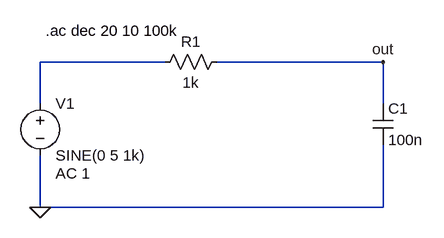
[diagram p0: schematic rc_high_pass_simple.asc]
rc_high_pass_simple.asc, the LTspice schematic file:
Version 4.1
SHEET 1 880 680
WIRE 160 -48 -32 -48
WIRE 496 -48 240 -48
WIRE -32 16 -32 -48
WIRE 496 16 496 -48
WIRE -32 176 -32 96
WIRE 496 176 496 80
WIRE 496 176 -32 176
FLAG -32 176 0
FLAG 496 -48 out
SYMBOL voltage -32 0 R0
WINDOW 123 24 124 Left 2
WINDOW 39 0 0 Left 0
SYMATTR Value2 AC 1
SYMATTR InstName V1
SYMATTR Value SINE(0 5 1k)
SYMBOL res 256 -64 R90
WINDOW 0 0 56 VBottom 2
WINDOW 3 32 56 VTop 2
SYMATTR InstName R1
SYMATTR Value 1k
SYMBOL cap 480 16 R0
SYMATTR InstName C1
SYMATTR Value 100n
TEXT -24 -96 Left 2 !.ac dec 20 10 100k

The netlist it stands for:
* rc_high_pass_simple.asc
V1 N001 0 SINE(0 5 1k) AC 1
R1 out N001 1k
C1 out 0 100n
.ac dec 20 10 100k
.backanno
.end

* Results of the author's LTspice run, read from the files saved beside the schematic
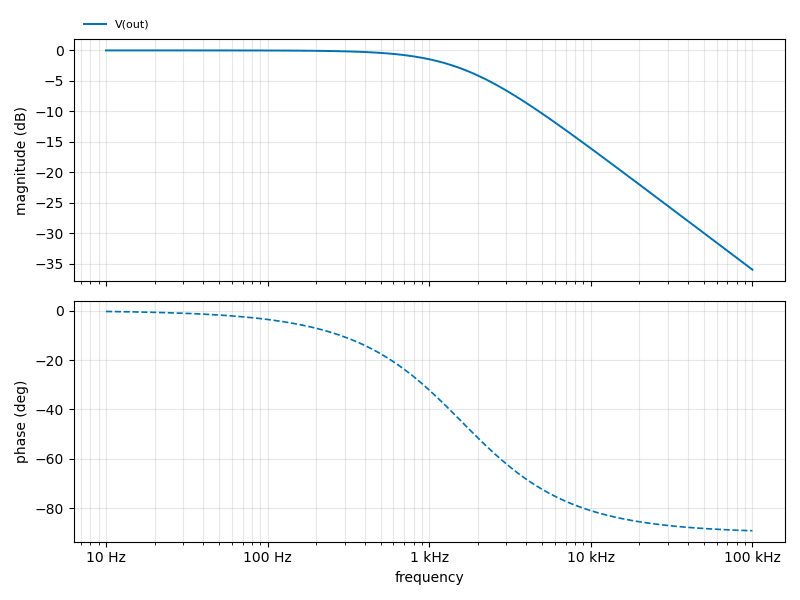
[diagram p1: AC Analysis of rc_high_pass_simple.asc, plotted from the saved traces]
* AC Analysis, 1 run:
*   V(out): -0.00 dB at 10 Hz, -35.96 dB at 100 kHz, peak -0.00 dB at 10 Hz, 3 dB below the peak at 1.591 kHz